# EasyEDA Pro project STC-FOC-C2822.epro, schematic 原理图_V2
Board Name: STC-FOC_V2; Create Date: 2025-03-10; Page Name: P1; Project Name: STC-FOC-C2822（测试中）; Schematic Name: 原理图_V2; Update Date: 2025-03-12; Company: 嘉立创EDA; Drawed: 王昱顺; Page Size: A3; Version: V1.0
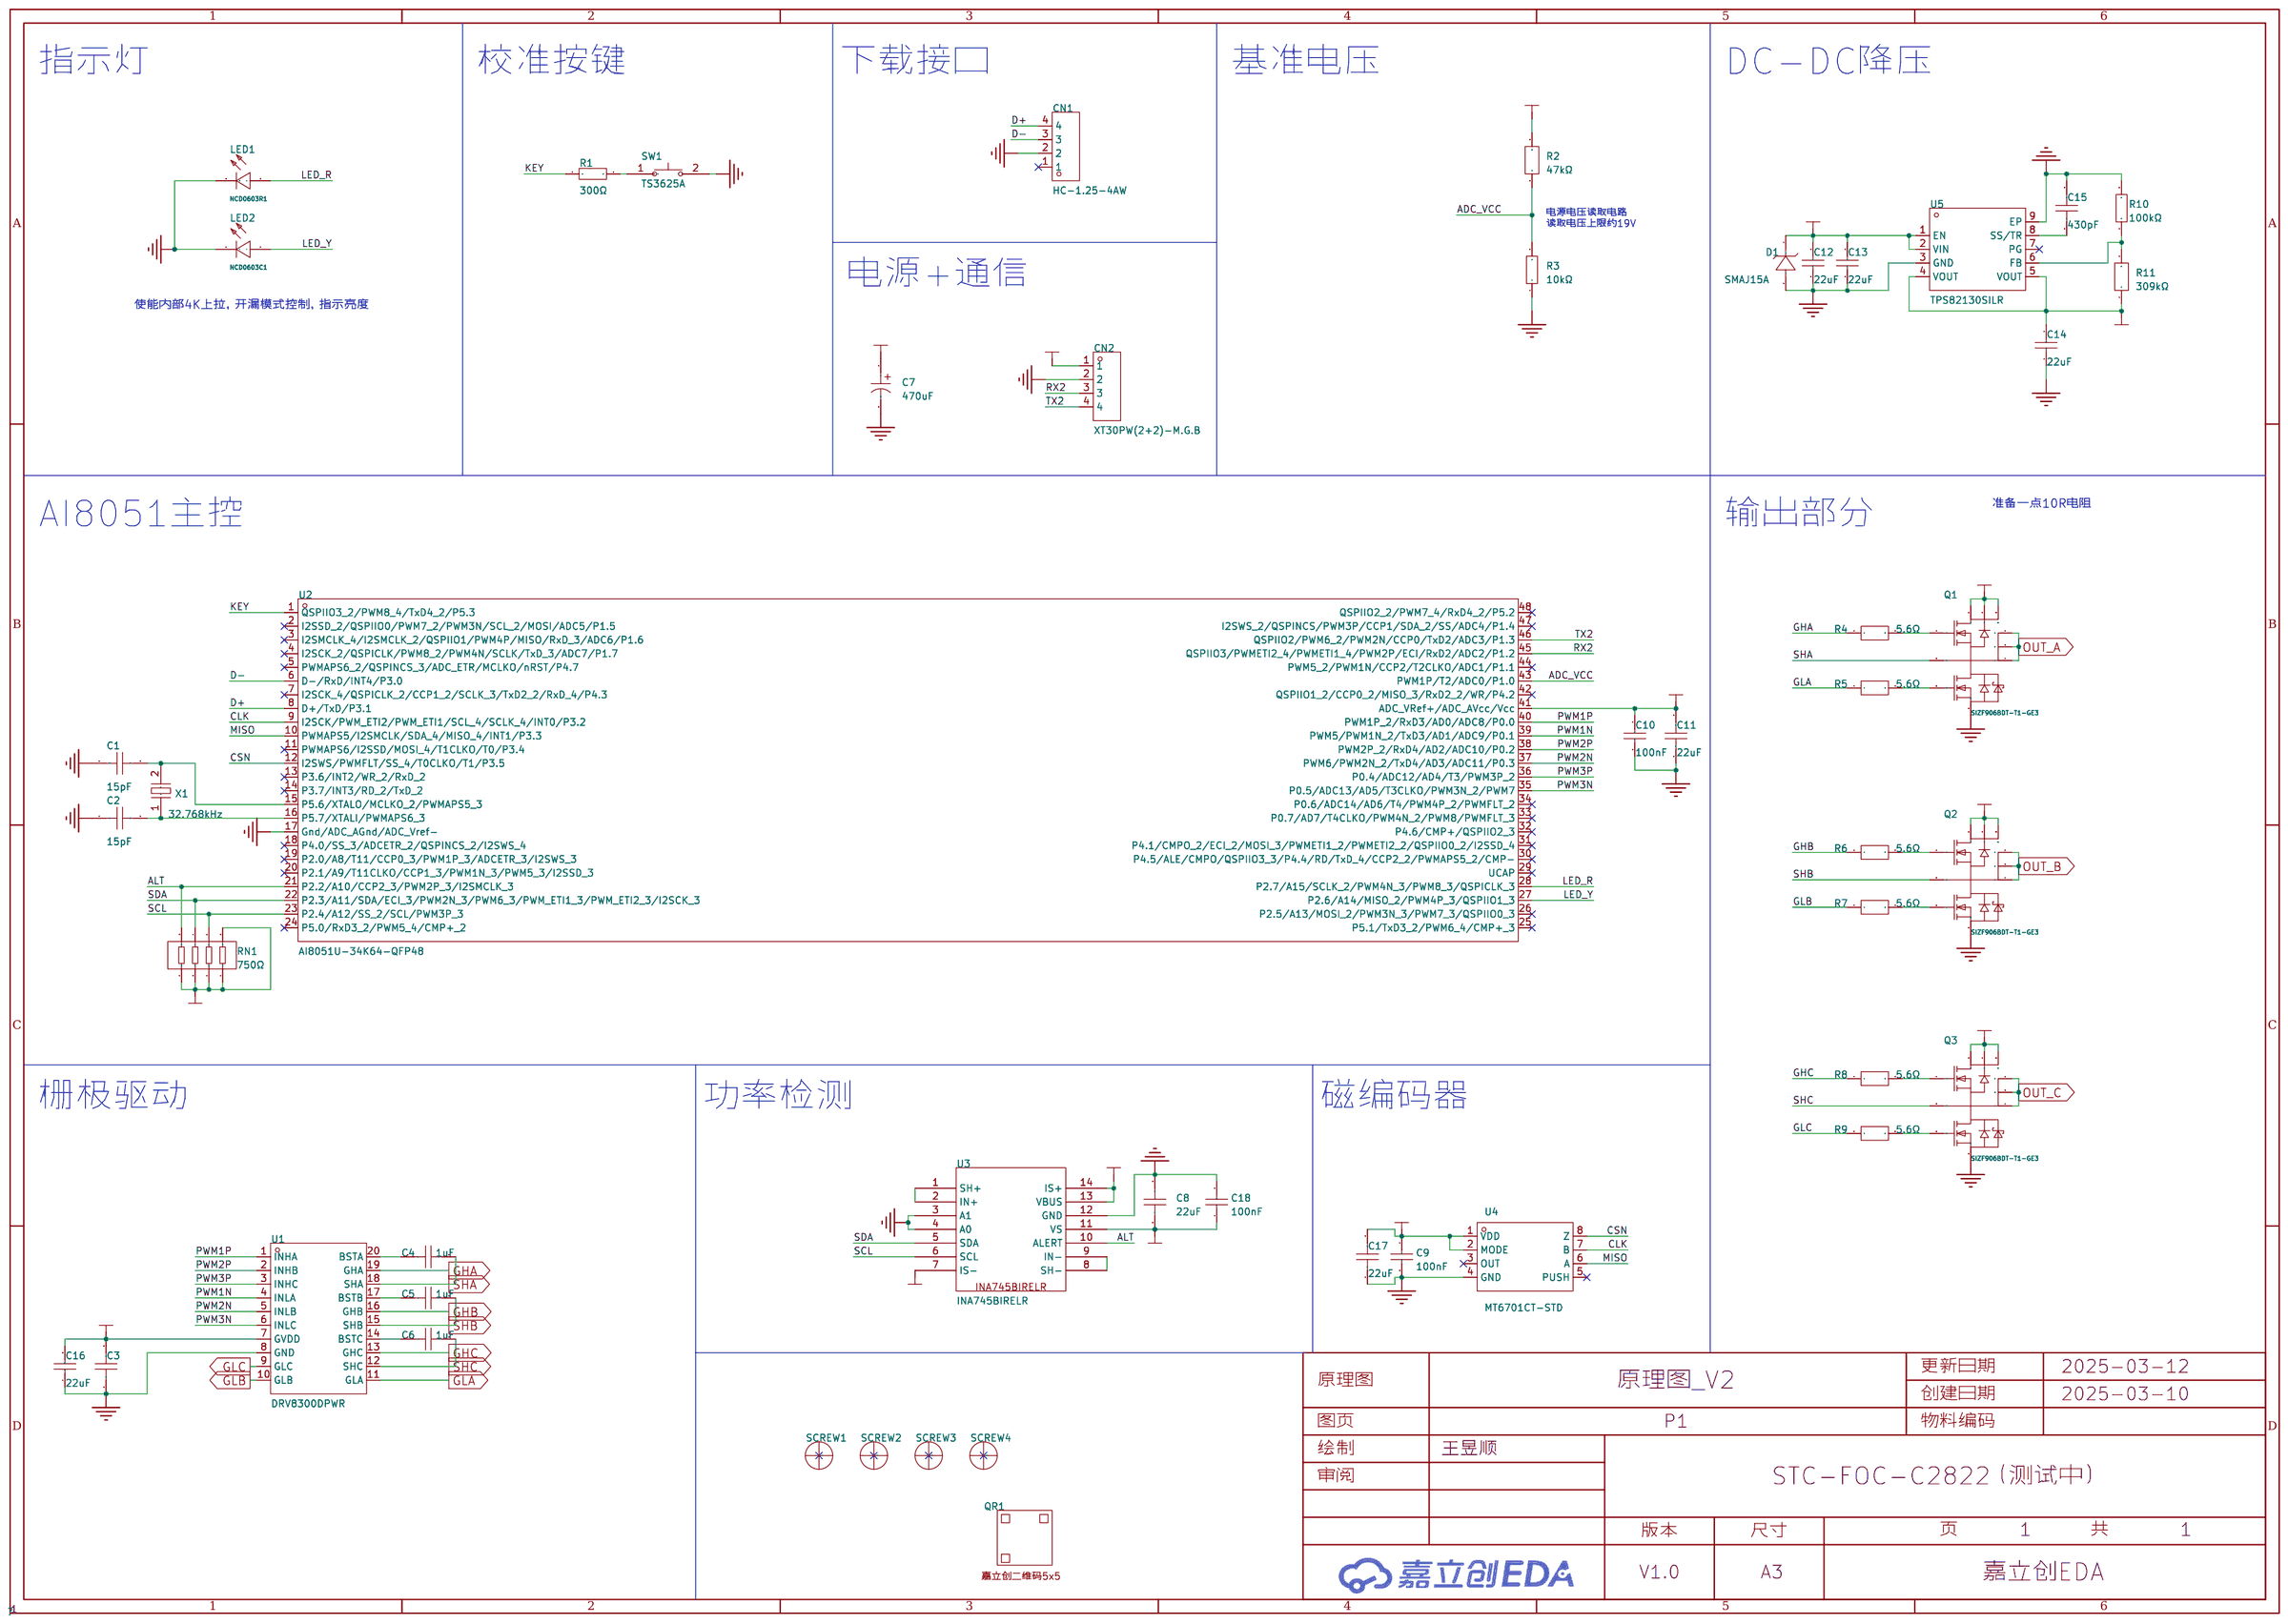
[diagram p1: schematic sheet]

## Parts
C1  15pF  [C0603]
C2  15pF  [C0603]
C3  100nF  [C0603]
C4  1uF  [C0603]
C5  1uF  [C0603]
C6  1uF  [C0603]
C7  470uF  [CAP-TH_BD6.3-P2.50-D0.6-FD-1]
C8  22uF  [C0603]
C9  100nF  [C0603]
C10  100nF  [C0603]
C11  22uF  [C0603]
C12  22uF  [C1206]
C13  22uF  [C1206]
C14  22uF  [C1206]
C15  430pF  [C0603]
C16  22uF  [C1206]
C17  22uF  [C0603]
C18  100nF  [C0603]
CN1  HC-1.25-4AW  [CONN-TH_4P-P1.25_HCTL_HC-1.25-4AW]
CN2  XT30PW(2+2)-M.G.B  [CONN-TH_4P-XT30PW-M]
D1  SMAJ15A  [SMA_L4.3-W2.6-LS5.0-RD]
LED1  NCD0603R1  [LED0603-RD_RED]
LED2  NCD0603C1  [LED0603-RD]
Q1  SIZF906BDT-T1-GE3  [PQFN-8_L6.0-W5.0-P1.27-BL-EP_ONSEMI_483AT]
Q2  SIZF906BDT-T1-GE3  [PQFN-8_L6.0-W5.0-P1.27-BL-EP_ONSEMI_483AT]
Q3  SIZF906BDT-T1-GE3  [PQFN-8_L6.0-W5.0-P1.27-BL-EP_ONSEMI_483AT]
QR1  -  [JLC-QRCODE-5x5]
R1  300Ω  [R0603]
R2  47kΩ  [R0603]
R3  10kΩ  [R0603]
R4  5.6Ω  [R0603]
R5  5.6Ω  [R0603]
R6  5.6Ω  [R0603]
R7  5.6Ω  [R0603]
R8  5.6Ω  [R0603]
R9  5.6Ω  [R0603]
R10  100kΩ  [R0603]
R11  309kΩ  [R0603]
RN1  750Ω  [RES-ARRAY-SMD_0603-8P-L3.2-W1.6-BL]
SCREW1  -  [M2螺丝]
SCREW2  -  [M2螺丝]
SCREW3  -  [M2螺丝]
SCREW4  -  [M2螺丝]
SW1  TS3625A  [KEY-SMD_L6.0-W3.5-LS8.4]
U1  DRV8300DPWR  [TSSOP-20_L6.5-W4.4-P0.65-LS6.4-BL]
U2  AI8051U-34K64-QFP48  [LQFP-48_L7.0-W7.0-P0.50-LS9.0-BL_1]
U3  INA745BIRELR  [VQFN14_REL_TEX]
U4  MT6701CT-STD  [SOP-8_L4.9-W3.9-P1.27-LS6.0-BL]
U5  TPS82130SILR  [USIP-8_L3.0-W2.8-P0.65-TL-EP]
X1  32.768kHz  [CRYSTAL-SMD_L3.2-W1.5]

## Library data of the parts
C1 C2 = CC0603FRNPO9BN150: 容值:15pF;精度:±1%;额定电压:50V;材质(温度系数):NP0;; LCSC Part Name: 15pF ±1% 50V; Supplier Part: C519483; Manufacturer: YAGEO(国巨); Supplier Footprint: 0603; JLCPCB Part Class: 扩展库; Datasheet: https://atta.szlcsc.com/upload/public/pdf/source/20200423/C519483_4C1E224DC9F50100F87DB4C4CB862A47.pdf; Supplier: LCSC; Tolerance: ±1%; Voltage Rated: 50V; Temperature Coefficient: NP0
C3 C9 C10 C18 = CC0603KRX7R9BB104: 容值:100nF;精度:±10%;额定电压:50V;材质(温度系数):X7R;; LCSC Part Name: 100nF ±10% 50V; Supplier Part: C14663; Manufacturer: YAGEO(国巨); Supplier Footprint: 0603; JLCPCB Part Class: Basic Part; Datasheet: https://atta.szlcsc.com/upload/public/pdf/source/20180910/C282072_33301C7F631E79921B82A8DAC6BCC5B3.pdf; Supplier: LCSC; Tolerance: ±10%; Voltage Rated: 50V; Temperature Coefficient: X7R
C4-C6 = CC0603KRX7R9BB105: 容值:1uF;精度:±10%;额定电压:50V;材质(温度系数):X7R;; LCSC Part Name: 1uF ±10% 50V; Supplier Part: C559769; Manufacturer: YAGEO(国巨); Supplier Footprint: 0603; JLCPCB Part Class: 扩展库; Datasheet: https://atta.szlcsc.com/upload/public/pdf/source/20181031/C325451_C7CF01155AE3010E0D610C52F5FE7D31.pdf; Supplier: LCSC; Tolerance: ±10%; Voltage Rated: 50V; Temperature Coefficient: X7R
C7 = HS1E477M0611PC: 容值:470uF;精度:±20%;额定电压:25V;; LCSC Part Name: 470uF ±20% 25V; Supplier Part: C2895783; Manufacturer: HONOR(荣誉); Supplier Footprint: 插件,D6.3xL11.5mm; JLCPCB Part Class: 扩展库; Datasheet: https://atta.szlcsc.com/upload/public/pdf/source/20210927/1B2638F74D3ADD8049274E86DFB3E076.pdf; Supplier: LCSC; Tolerance: ±20%; Rated Voltage: 25V; φD: 6.3mm; L: 11.5mm; Lifetime @ Temp: 2000hrs@105℃; Operating Temperature: -55℃~+105℃
C8 C11 C17 = CL10A226MQ8NRNC: 容值:22uF;精度:±20%;额定电压:6.3V;材质(温度系数):X5R;; LCSC Part Name: 22uF ±20% 6.3V; Supplier Part: C59461; Manufacturer: SAMSUNG(三星); Supplier Footprint: 0603; JLCPCB Part Class: Basic Part; Datasheet: https://atta.szlcsc.com/upload/public/pdf/source/20160218/1457707763339.pdf; Supplier: LCSC; Tolerance: ±20%; Voltage Rated: 6.3V; Temperature Coefficient: X5R
C12-C14 C16 = GRM31CR61E226KE15L: 容值:22uF;精度:±10%;额定电压:25V;材质(温度系数):X5R;; LCSC Part Name: 22uF ±10% 25V; Supplier Part: C77091; Manufacturer: muRata(村田); Supplier Footprint: 1206; JLCPCB Part Class: 扩展库; Datasheet: https://atta.szlcsc.com/upload/public/pdf/source/20200305/C490387_23319AE8C154DEB24C505E6C82A8106A.pdf; Supplier: LCSC; Tolerance: ±10%; Voltage Rated: 25V; Temperature Coefficient: X5R
C15 = GRM1885C1H431JA01D: 容值:430pF;精度:±5%;额定电压:50V;材质(温度系数):C0G;; LCSC Part Name: 430pF ±5% 50V; Supplier Part: C440182; Manufacturer: muRata(村田); Supplier Footprint: 0603; JLCPCB Part Class: 扩展库; Datasheet: https://atta.szlcsc.com/upload/public/pdf/source/20191022/C440211_D691AF4420B7318595498C3E4B7F2331.pdf; Supplier: LCSC; Tolerance: ±5%; Voltage Rated: 50V; Temperature Coefficient: C0G
CN1 = HC-1.25-4AW: 插针结构:1x4P;间距:1.25mm;安装方式:弯插;参考系列:PicoBlade(MX 1.25);总PIN数:4P;排数:1;每排PIN数:4;行距:-;额定电流:1A;触头材质:黄铜;触头镀层:锡;工作温度范围:-25℃~+85℃;; LCSC Part Name: 1x4P 间距:1.25mm 弯插 系列:PicoBlade(MX 1.25); Supplier Part: C2845537; Manufacturer: HCTL(华灿天禄); Supplier Footprint: 弯插,P=1.25mm; JLCPCB Part Class: 扩展库; Datasheet: https://atta.szlcsc.com/upload/public/pdf/source/20230707/04F6BEA69F699E7BB6558EF06AF1DC24.pdf; Supplier: LCSC; Pins Structure: 1x4P; Pitch: 1.25mm; Mounting Style: 弯插; Reference Series: PicoBlade(MX 1.25); Number of Pins: 4P; Number of Rows: 1; Number of PINs Per Row: 4; Current Rating (Max): 1A; Contact Material: 黄铜; Contact Plating: 锡; Operating Temperature Range: -25℃~+85℃; Rated Voltage (Max): 125V; Plastic Material: PA46; Flame Retardant Rating: UL94V-0; Z-Height of the Board: 3.2mm; X-Length of Bottom Edge on Board (Spacing Line): 6.75mm; Y-Width of Bottom Edge on Board: 4.7mm
CN2 = XT30PW(2+2)-M.G.B: LCSC Part Name: XT30PW(2+2)功率数据混合插头公金黑PCB弯插; Supplier Part: C19268030; Manufacturer: AMASS(艾迈斯); JLCPCB Part Class: 扩展库; Datasheet: https://atta.szlcsc.com/upload/public/pdf/source/20240112/A815AE62CB016131F8636555ECBDABF7.pdf; Supplier: LCSC
D1 = SMAJ15A_C19077535: 极性:单向;反向截止电压(Vrwm):15V;钳位电压:24.4V;峰值脉冲电流(Ipp):16.4A;峰值脉冲功率(Ppp):400W;击穿电压:16.7V;; Supplier Part: C19077535; Manufacturer: 宏嘉诚; Supplier Footprint: SMA; JLCPCB Part Class: 扩展库; Datasheet: https://atta.szlcsc.com/upload/public/pdf/source/20250107/539D2DC1EE5F9F3FCEFE35DA61E92AD9.pdf; Supplier: LCSC; Polarity: 单向; Reverse Stand-Off Voltage (Vrwm): 15V; Clamping Voltage: 24.4V; Peak Pulse Current (Ipp): 16.4A; Peak Pulse Power Dissipation (Ppp): 400W; Voltage - Breakdown: 16.7V; Reverse Leakage Current (Ir): 1uA; Number of Channels: 单路; Type: TVS
LED1 = NCD0603R1_C84263: 灯头类型:-;发光颜色:红色;正向电压(VF):1.6V~2.6V;功率:65mW;正向电流:20mA;主波长:615nm~630nm;二极管配置:独立二极管;透镜颜色:无色透明透镜;色温:-;发光强度:80mcd~220mcd;发光角度:130°;载带方式:-;工作温度:-30℃~+85℃;; Supplier Part: C84263; Manufacturer: 国星光电; Supplier Footprint: 0603; JLCPCB Part Class: 扩展库; Datasheet: https://atta.szlcsc.com/upload/public/pdf/source/20200820/C84263_DABC6A75E58F576973B407FDBA283D60.pdf; Supplier: LCSC; Emitted Color: 红色; Forward Voltage (VF): 1.6V~2.6V; Power Dissipation: 65mW; Forward Current: 20mA; Dominant Wavelength: 615nm~630nm; Diode Configuration: 独立二极管; Lens Color: 无色透明透镜; Luminous Intensity: 80mcd~220mcd; Viewing Angle: 130°; Operating Temperature: -30℃~+85℃
LED2 = NCD0603C1: 发光颜色:黄绿色;正向电压(VF):1.6V~2.6V;功率:65mW;正向电流:5mA;主波长:565nm~578nm;透镜颜色:无色透明透镜;发光强度:5mcd~13mcd;发光角度:140°;工作温度:-30℃~+85℃;; Supplier Part: C84264; Manufacturer: 国星光电; Supplier Footprint: 0603; JLCPCB Part Class: 扩展库; Datasheet: https://atta.szlcsc.com/upload/public/pdf/source/20200820/C84264_94B2FEF0C4ADFC9200EBC3AD62A401B4.pdf; Supplier: LCSC; Emitted Color: 黄绿色; Forward Voltage (VF): 1.6V~2.6V; Power Dissipation: 65mW; Forward Current: 5mA; Dominant Wavelength: 565nm~578nm; Lens Color: 无色透明透镜; Luminous Intensity: 5mcd~13mcd; Viewing Angle: 140°; Operating Temperature: -30℃~+85℃
Q1-Q3 = SIZF906BDT-T1-GE3: 类型:2个N沟道;漏源电压(Vdss):30V;连续漏极电流(Id):257A;导通电阻(RDS(on)):0.68mΩ@10V,257A;耗散功率(Pd):5W;阈值电压(Vgs(th)):1.1V;; LCSC Part Name: 2个N沟道 耐压:30V 电流:257A; Supplier Part: C3279431; Manufacturer: VISHAY(威世); Supplier Footprint: PowerPAIR-8(6x5); JLCPCB Part Class: 扩展库; Datasheet: https://atta.szlcsc.com/upload/public/pdf/source/20240403/3BB01E8529755B783C4B36278FAAE48A.pdf; Supplier: LCSC; Type: 2个N沟道; Drain to Source Voltage: 30V; Current - Continuous Drain(Id): 257A; RDS(on): 0.68mΩ@10V,257A; Pd - Power Dissipation: 5W; Gate Threshold Voltage (Vgs(th)@Id): 1.1V; Gate Charge(Qg): 38nC@10V; Input Capacitance(Ciss@Vds): 5.55nF@10V; Reverse Transfer Capacitance (Crss@Vds): 205pF@15V; Operating Temperature: -55℃~+150℃
QR1 = 嘉立创二维码5x5: Check: false
R1 = RC0603FR-07300RL: 电阻类型:厚膜电阻;阻值:300Ω;精度:±1%;功率:100mW;最大工作电压:75V;温度系数:±100ppm/℃;; LCSC Part Name: 厚膜电阻 300Ω ±1% 100mW; Supplier Part: C114617; Manufacturer: YAGEO(国巨); Supplier Footprint: 0603; JLCPCB Part Class: 扩展库; Datasheet: https://atta.szlcsc.com/upload/public/pdf/source/20180821/C275644_0D56F95EFF785E7D9A1FEF436B37DA78.pdf; Supplier: LCSC; Type: 厚膜电阻; Tolerance: ±1%; Power(Watts): 100mW; Overload Voltage (Max): 75V; Temperature Coefficient: ±100ppm/℃; Operating Temperature Range: -55℃~+155℃
R2 = FRC0603F4702TS: 电阻类型:厚膜电阻;阻值:47kΩ;精度:±1%;功率:100mW;最大工作电压:75V;温度系数:±100ppm/℃;; LCSC Part Name: 47kΩ ±1% 100mW 厚膜电阻; Supplier Part: C2907042; Manufacturer: FOJAN(富捷); Supplier Footprint: 0603; JLCPCB Part Class: 扩展库; Datasheet: https://atta.szlcsc.com/upload/public/pdf/source/20211221/925EC7D7225764EE0046F22065062C87.pdf; Supplier: LCSC; Type: 厚膜电阻; Tolerance: ±1%; Power(Watts): 100mW; Overload Voltage (Max): 75V; Temperature Coefficient: ±100ppm/℃; Operating Temperature Range: -55℃~+155℃
R3 = 0603WAF1002T5E: 电阻类型:厚膜电阻;阻值:10kΩ;精度:±1%;功率:100mW;最大工作电压:75V;温度系数:±100ppm/℃;; LCSC Part Name: 10kΩ ±1% 100mW 厚膜电阻; Supplier Part: C25804; Manufacturer: UNI-ROYAL(厚声); Supplier Footprint: 0603; Datasheet: https://atta.szlcsc.com/upload/public/pdf/source/20200306/C422600_1E6D84923E4A46A82E41ADD87F860B5C.pdf; Supplier: LCSC; Type: 厚膜电阻; Tolerance: ±1%; Power(Watts): 100mW; Overload Voltage (Max): 75V; Temperature Coefficient: ±100ppm/℃; Operating Temperature Range: -55℃~+155℃
R4-R9 = FRC0603F5R60TS: 电阻类型:厚膜电阻;阻值:5.6Ω;精度:±1%;功率:100mW;最大工作电压:75V;温度系数:±200ppm/℃;; LCSC Part Name: 5.6Ω ±1% 100mW 厚膜电阻; Supplier Part: C2933244; Manufacturer: FOJAN(富捷); Supplier Footprint: 0603; JLCPCB Part Class: 扩展库; Datasheet: https://atta.szlcsc.com/upload/public/pdf/source/20211221/925EC7D7225764EE0046F22065062C87.pdf; Supplier: LCSC; Type: 厚膜电阻; Tolerance: ±1%; Power(Watts): 100mW; Overload Voltage (Max): 75V; Temperature Coefficient: ±200ppm/℃; Operating Temperature Range: -55℃~+155℃
R10 = 0603WAF1003T5E: 电阻类型:厚膜电阻;阻值:100kΩ;精度:±1%;功率:100mW;最大工作电压:75V;温度系数:±100ppm/℃;; LCSC Part Name: 100kΩ ±1% 100mW 厚膜电阻; Supplier Part: C25803; Manufacturer: UNI-ROYAL(厚声); Supplier Footprint: 0603; JLCPCB Part Class: 基础库; Datasheet: https://atta.szlcsc.com/upload/public/pdf/source/20200306/C422600_1E6D84923E4A46A82E41ADD87F860B5C.pdf; Supplier: LCSC; Type: 厚膜电阻; Tolerance: ±1%; Power(Watts): 100mW; Overload Voltage (Max): 75V; Temperature Coefficient: ±100ppm/℃; Operating Temperature Range: -55℃~+155℃
R11 = FRC0603F3093TS: 电阻类型:厚膜电阻;阻值:309kΩ;精度:±1%;功率:100mW;最大工作电压:75V;温度系数:±100ppm/℃;; LCSC Part Name: 309kΩ ±1% 100mW 厚膜电阻; Supplier Part: C2999532; Manufacturer: FOJAN(富捷); Supplier Footprint: 0603; JLCPCB Part Class: 扩展库; Datasheet: https://atta.szlcsc.com/upload/public/pdf/source/20211221/925EC7D7225764EE0046F22065062C87.pdf; Supplier: LCSC; Type: 厚膜电阻; Tolerance: ±1%; Power(Watts): 100mW; Overload Voltage (Max): 75V; Temperature Coefficient: ±100ppm/℃
RN1 = YC164-FR-07750RL: 电阻器数:4;阻值:750Ω;精度:±1%;单个元件功率:62.5mW;温度系数:±200ppm/℃;; LCSC Part Name: 750Ω ±1%; Supplier Part: C728924; Manufacturer: YAGEO(国巨); Supplier Footprint: 0603x4; JLCPCB Part Class: 扩展库; Datasheet: https://atta.szlcsc.com/upload/public/pdf/source/20181031/C327050_39CFA27C782DBE929FAF5847D7485F94.pdf; Supplier: LCSC; Number of Resistors: 4; Tolerance: ±1%; Power(Watts): 62.5mW; Temperature Coefficient: ±200ppm/℃; Number of Pins: 8
SCREW1-SCREW4 = M2螺丝: Check: false
SW1 = TS3625A: 电路结构:单刀单掷;按钮形状:矩形按钮;开关长度:6.1mm;开关宽度:3.65mm;开关高度:2.5mm;触点电流:50mA;额定电压(DC):12V;安装方式:立贴;带灯:-;作用力:250gf;机械寿命:-;; LCSC Part Name: 6.1*3.65*2.5mm 立贴 轻触开关; Supplier Part: C398053; Manufacturer: SHOU HAN(首韩); Supplier Footprint: SMD; Datasheet: https://atta.szlcsc.com/upload/public/pdf/source/20190620/C398053_EFFFB524A3F966B1F45EE8333D1EDECC.pdf; Supplier: LCSC; Circuit: 单刀单掷; Actuator Style: 矩形按钮; Switch Length: 6.1mm; Switch Width: 3.65mm; Switch Height: 2.5mm; Contact Current: 50mA; Voltage Rating (DC): 12V; Mounting Style: 立贴; Operating Force: 250gf
U1 = DRV8300DPWR: DRV8300 具有自举二极管的最大 100V 简单三相栅极驱动器; Supplier Part: C3036056; Manufacturer: TI(德州仪器); Supplier Footprint: TSSOP-20; JLCPCB Part Class: 扩展库; Datasheet: https://www.ti.com/cn/lit/gpn/drv8300; Supplier: LCSC
U2 = AI8051U-34K64-QFP48: 硬件浮点/硬件三角函数 跑100MHz, 32位8051-CPU 跑 42MHz，PWM 有硬件移相功能，DMA支持外设到外设，DMA支持PWM; Supplier Part: C41427635; Manufacturer: STC; Supplier Footprint: QFP-48; JLCPCB Part Class: 扩展库; Datasheet: https://atta.szlcsc.com/upload/public/pdf/source/20241012/98E0A3F17C9CC280218AE3F266CCDE47.pdf; Supplier: LCSC
U3 = INA745BIRELR: Type: Power Management; Mfr_Name: Texas Instruments; Check: false
U4 = MT6701CT-STD: 磁性编码器 磁性编码开关 磁性角度检测IC 可编程磁性角度位置芯片; LCSC Part Name: 霍尔在线编程角度位置传感器; Supplier Part: C2856764; Manufacturer: MagnTek(麦歌恩); Supplier Footprint: SOP-8; Datasheet: https://atta.szlcsc.com/upload/public/pdf/source/20210901/89396AA55DF26524CEF7734A3D9C2FB3.pdf; Supplier: LCSC
U5 = TPS82130SILR: TPS82130 TPS82130 具有集成电感的 3A 17V 降压转换器; Supplier Part: C473914; Manufacturer: TI(德州仪器); Supplier Footprint: USIP-8; JLCPCB Part Class: 扩展库; Datasheet: https://www.ti.com/cn/lit/gpn/tps82130; Supplier: LCSC
X1 = Q13FC13500005: 晶振类型:贴片晶振;频率:32.768kHz;常温频差:±10ppm;外接负载电容:12.5pF;; LCSC Part Name: 32.768kHz ±10ppm 12.5pF; Supplier Part: C841881; Manufacturer: EPSON(爱普生); Supplier Footprint: SMD3215-2P; JLCPCB Part Class: 扩展库; Datasheet: https://atta.szlcsc.com/upload/public/pdf/source/20200925/C841881_B5011FDE44C88701FACF3BC62E48B4DA.pdf; Supplier: LCSC; Crystal Type: 贴片晶振; Normal temperature Frequency Tolerance: ±10ppm; External load capacitor: 12.5pF; Equivalent Series Resistance (ESR): 70kΩ; Operating Temperature: -40℃~+85℃

## Nets
3V3: C8.2 C9.2 C10.2 C11.2 C14.2 C17.2 C18.1 R11.1 RN1.1 RN1.2 RN1.3 RN1.4 RN1.5 U2.41(ADC_VRef+/ADC_AVcc/Vcc) U3.11(VS) U4.1(VDD) U4.2(MODE) U5.4(VOUT) U5.5(VOUT)
+9V: C3.2 C7.1 C12.2 C13.2 C16.2 CN2.1 D1.1(K) R2.2 U1.7(GVDD) U3.13(VBUS) U3.14(IS+) U5.1(EN) U5.2(VIN)
GND: C1.1 C2.1 C3.1 C7.2 C8.1 C9.1 C10.1 C11.1 C12.1 C13.1 C14.1 C15.2 C16.1 C17.1 C18.2 CN1.2 CN2.2 D1.2(A) LED1.1(K) LED2.1(-) Q1.9 Q2.9 Q3.9 R3.1 R10.2 SW1.2 U1.8(GND) U2.17(Gnd/ADC_AGnd/ADC_Vref-) U3.3(A1) U3.4(A0) U3.12(GND) U4.4(GND) U5.3(GND) U5.9(EP)
PVCC: Q1.3 Q1.4 Q1.10 Q2.3 Q2.4 Q2.10 Q3.3 Q3.4 Q3.10 U3.7(IS-)
ADC_VCC: R2.1 R3.2 U2.43(PWM1P/T2/ADC0/P1.0)
ALT: RN1.8 U2.21(P2.2/A10/CCP2_3/PWM2P_3/I2SMCLK_3) U3.10(ALERT)
CLK: U2.9(I2SCK/PWM_ETI2/PWM_ETI1/SCL_4/SCLK_4/INT0/P3.2) U4.7(B)
CSN: U2.12(I2SWS/PWMFLT/SS_4/T0CLKO/T1/P3.5) U4.8(Z)
D+: CN1.4 U2.8(D+/TxD/P3.1)
D-: CN1.3 U2.6(D-/RxD/INT4/P3.0)
GHA: R4.1 U1.19(GHA)
GHB: R6.1 U1.16(GHB)
GHC: R8.1 U1.13(GHC)
GLA: R5.1 U1.11(GLA)
GLB: R7.1 U1.10(GLB)
GLC: R9.1 U1.9(GLC)
KEY: R1.1 U2.1(QSPIIO3_2/PWM8_4/TxD4_2/P5.3)
LED_R: LED1.2(A) U2.28(P2.7/A15/SCLK_2/PWM4N_3/PWM8_3/QSPICLK_3)
LED_Y: LED2.2(+) U2.27(P2.6/A14/MISO_2/PWM4P_3/QSPIIO1_3)
MISO: U2.10(PWMAPS5/I2SMCLK/SDA_4/MISO_4/INT1/P3.3) U4.6(A)
OUT_A: Q1.5 Q1.6 Q1.7
OUT_B: Q2.5 Q2.6 Q2.7
OUT_C: Q3.5 Q3.6 Q3.7
PWM1N: U1.4(INLA) U2.39(PWM5/PWM1N_2/TxD3/AD1/ADC9/P0.1)
PWM1P: U1.1(INHA) U2.40(PWM1P_2/RxD3/AD0/ADC8/P0.0)
PWM2N: U1.5(INLB) U2.37(PWM6/PWM2N_2/TxD4/AD3/ADC11/P0.3)
PWM2P: U1.2(INHB) U2.38(PWM2P_2/RxD4/AD2/ADC10/P0.2)
PWM3N: U1.6(INLC) U2.35(P0.5/ADC13/AD5/T3CLKO/PWM3N_2/PWM7)
PWM3P: U1.3(INHC) U2.36(P0.4/ADC12/AD4/T3/PWM3P_2)
RX2: CN2.3 U2.45(QSPIIO3/PWMETI2_4/PWMETI1_4/PWM2P/ECI/RxD2/ADC2/P1.2)
SCL: RN1.6 U2.23(P2.4/A12/SS_2/SCL/PWM3P_3) U3.6(SCL)
SDA: RN1.7 U2.22(P2.3/A11/SDA/ECI_3/PWM2N_3/PWM6_3/PWM_ETI1_3/PWM_ETI2_3/I2SCK_3) U3.5(SDA)
SHA: C4.1 Q1.2 U1.18(SHA)
SHB: C5.1 Q2.2 U1.15(SHB)
SHC: C6.1 Q3.2 U1.12(SHC)
TX2: CN2.4 U2.46(QSPIIO2/PWM6_2/PWM2N/CCP0/TxD2/ADC3/P1.3)
$1N7270: C2.2 U2.16(P5.7/XTALI/PWMAPS6_3) X1.1
$1N7283: C1.2 U2.15(P5.6/XTALO/MCLKO_2/PWMAPS5_3) X1.2(GND)
$1N55931: R1.2 SW1.1
$1N57228: C15.1 U5.8(SS/TR)
$1N57378: R10.1 R11.2 U5.6(FB)
$1N57561: U3.1(SH+) U3.2(IN+)
$1N57568: U3.8(SH-) U3.9(IN-)
$1N58049: C4.2 U1.20(BSTA)
$1N58059: C5.2 U1.17(BSTB)
$1N58070: C6.2 U1.14(BSTC)
$1N58474: Q1.1 R4.2
$1N58515: Q1.8 R5.2
$1N58820: Q2.1 R6.2
$1N58822: Q2.8 R7.2
$1N59023: Q3.1 R8.2
$1N59025: Q3.8 R9.2

Not connected (* = marked no-connect by the designer): CN1 1*; SCREW1 1*; SCREW2 1*; SCREW3 1*; SCREW4 1*; U2 2(I2SSD_2/QSPIIO0/PWM7_2/PWM3N/SCL_2/MOSI/ADC5/P1.5)* 3(I2SMCLK_4/I2SMCLK_2/QSPIIO1/PWM4P/MISO/RxD_3/ADC6/P1.6)* 4(I2SCK_2/QSPICLK/PWM8_2/PWM4N/SCLK/TxD_3/ADC7/P1.7)* 5(PWMAPS6_2/QSPINCS_3/ADC_ETR/MCLKO/nRST/P4.7)* 7(I2SCK_4/QSPICLK_2/CCP1_2/SCLK_3/TxD2_2/RxD_4/P4.3)* 11(PWMAPS6/I2SSD/MOSI_4/T1CLKO/T0/P3.4)* 13(P3.6/INT2/WR_2/RxD_2)* 14(P3.7/INT3/RD_2/TxD_2)* 18(P4.0/SS_3/ADCETR_2/QSPINCS_2/I2SWS_4)* 19(P2.0/A8/T11/CCP0_3/PWM1P_3/ADCETR_3/I2SWS_3)* 20(P2.1/A9/T11CLKO/CCP1_3/PWM1N_3/PWM5_3/I2SSD_3)* 24(P5.0/RxD3_2/PWM5_4/CMP+_2)* 25(P5.1/TxD3_2/PWM6_4/CMP+_3)* 26(P2.5/A13/MOSI_2/PWM3N_3/PWM7_3/QSPIIO0_3)* 29(UCAP)* 30(P4.5/ALE/CMPO/QSPIIO3_3/P4.4/RD/TxD_4/CCP2_2/PWMAPS5_2/CMP-)* 31(P4.1/CMPO_2/ECI_2/MOSI_3/PWMETI1_2/PWMETI2_2/QSPIIO0_2/I2SSD_4)* 32(P4.6/CMP+/QSPIIO2_3)* 33(P0.7/AD7/T4CLKO/PWM4N_2/PWM8/PWMFLT_3)* 34(P0.6/ADC14/AD6/T4/PWM4P_2/PWMFLT_2)* 42(QSPIIO1_2/CCP0_2/MISO_3/RxD2_2/WR/P4.2)* 44(PWM5_2/PWM1N/CCP2/T2CLKO/ADC1/P1.1)* 47(I2SWS_2/QSPINCS/PWM3P/CCP1/SDA_2/SS/ADC4/P1.4)* 48(QSPIIO2_2/PWM7_4/RxD4_2/P5.2)*; U4 3(OUT)* 5(PUSH)*; U5 7(PG)*

## Notes on the sheet
- 指示灯
- 校准按键
- 下载接口
- 基准电压
- DC-DC降压
- 电源电压读取电路
  读取电压上限约19V
- 电源+通信
- 使能内部4K上拉，开漏模式控制，指示亮度
- 准备一点10R电阻
- AI8051主控
- 输出部分
- 栅极驱动
- 功率检测
- 磁编码器
